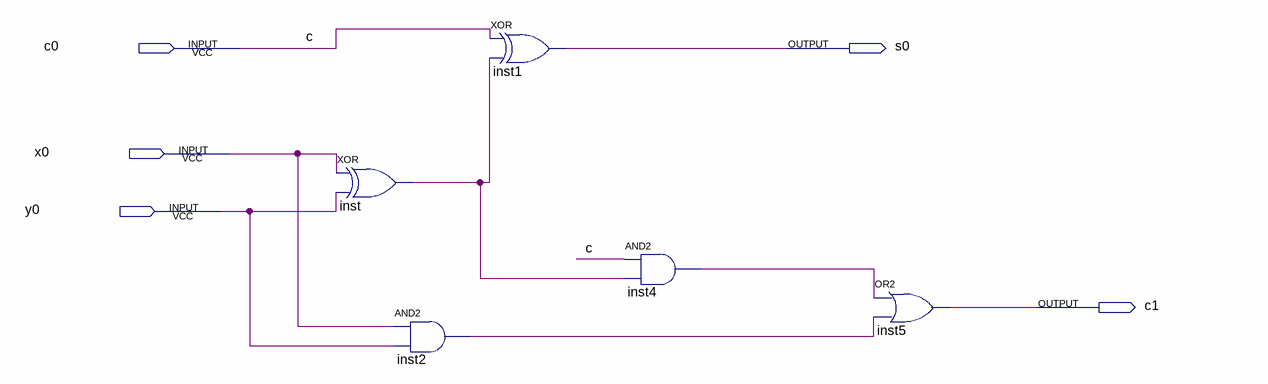
[diagram p0: schematic sheet]
// Quartus schematic full.bdf as structural Verilog: 5 symbols, 5 pins
module full (
  input  c0,
  input  x0,
  input  y0,
  output s0,
  output c1
);

  wire inst2_out, inst4_out, inst_out;

  xor inst (inst_out, x0, y0);
  and inst2 (inst2_out, x0, y0);
  xor inst1 (s0, c0, inst_out);
  and inst4 (inst4_out, c0, inst_out);
  or inst5 (c1, inst4_out, inst2_out);

  // Other names for the same wires on the sheet: c = c0
endmodule
